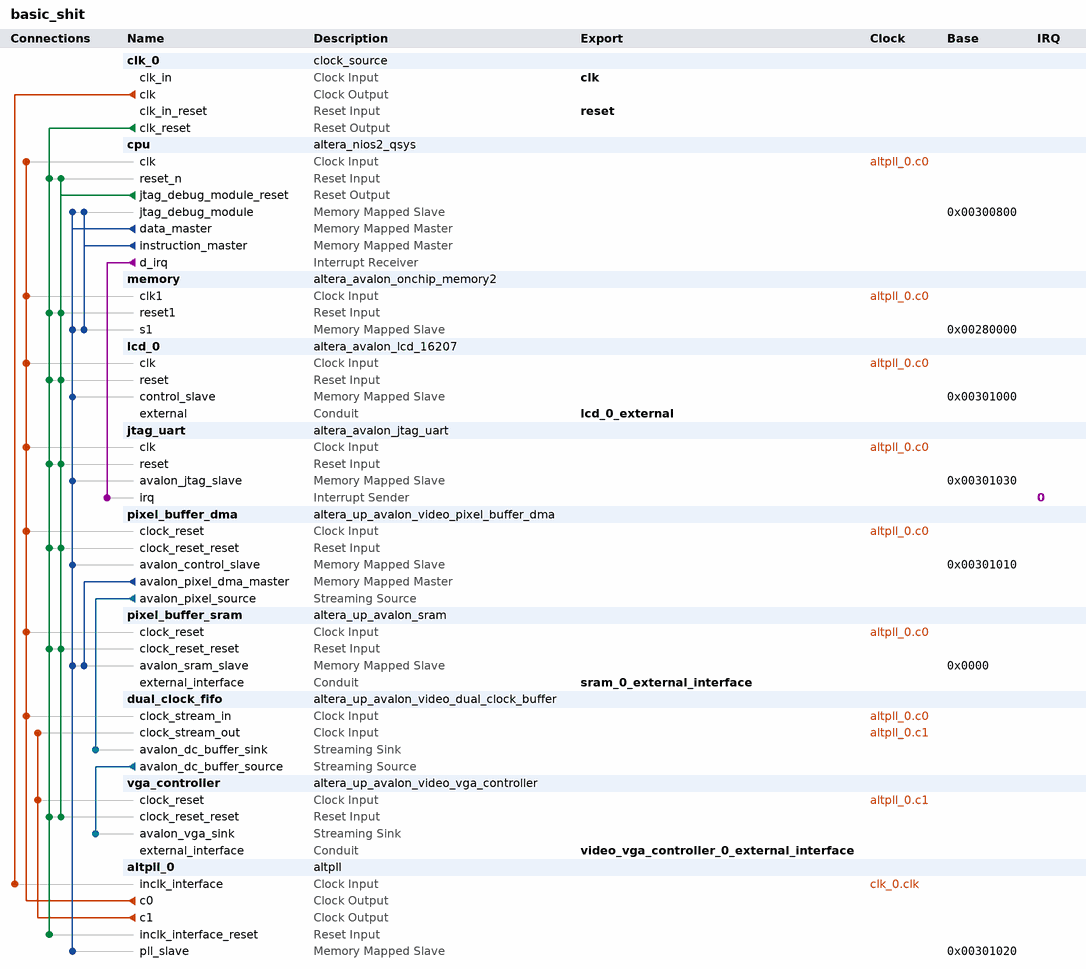
[diagram p0: system contents]
# Platform Designer (Qsys) system basic_shit
# Parameters at their usual value, and those the tool derives, are not listed.
package require -exact qsys 11.0
create_system basic_shit
set_project_property DEVICE_FAMILY CYCLONEIVE

add_instance clk_0 clock_source 11.0
set_instance_parameter_value clk_0 clockFrequency 50000000

add_instance cpu altera_nios2_qsys 11.0
set_instance_parameter_value cpu manuallyAssignCpuID false
set_instance_parameter_value cpu resetSlave memory.s1
set_instance_parameter_value cpu exceptionSlave memory.s1
set_instance_parameter_value cpu breakSlave cpu.jtag_debug_module
set_instance_parameter_value cpu impl Fast
set_instance_parameter_value cpu icache_size 4096

add_instance memory altera_avalon_onchip_memory2 11.0
set_instance_parameter_value memory dataWidth 32
set_instance_parameter_value memory dualPort false
set_instance_parameter_value memory initMemContent true
set_instance_parameter_value memory initializationFileName memory
set_instance_parameter_value memory memorySize 310000

add_instance lcd_0 altera_avalon_lcd_16207 11.0

add_instance jtag_uart altera_avalon_jtag_uart 11.0
set_instance_parameter_value jtag_uart simInteractiveOptions INTERACTIVE_ASCII_OUTPUT

add_instance pixel_buffer_dma altera_up_avalon_video_pixel_buffer_dma 11.0
set_instance_parameter_value pixel_buffer_dma addr_mode X-Y
set_instance_parameter_value pixel_buffer_dma start_address 0
set_instance_parameter_value pixel_buffer_dma back_start_address 0
set_instance_parameter_value pixel_buffer_dma image_width 640
set_instance_parameter_value pixel_buffer_dma image_height 480
set_instance_parameter_value pixel_buffer_dma color_space {30-bit RGB}

add_instance pixel_buffer_sram altera_up_avalon_sram 11.0
set_instance_parameter_value pixel_buffer_sram board DE2-115
set_instance_parameter_value pixel_buffer_sram pixel_buffer true

add_instance dual_clock_fifo altera_up_avalon_video_dual_clock_buffer 11.0
set_instance_parameter_value dual_clock_fifo color_bits 10

add_instance vga_controller altera_up_avalon_video_vga_controller 11.0
set_instance_parameter_value vga_controller board DE2-115

add_instance altpll_0 altpll 11.0
set_instance_parameter_value altpll_0 INCLK0_INPUT_FREQUENCY 20000
set_instance_parameter_value altpll_0 CLK0_MULTIPLY_BY 1
set_instance_parameter_value altpll_0 CLK1_MULTIPLY_BY 1
set_instance_parameter_value altpll_0 CLK0_DIVIDE_BY 1
set_instance_parameter_value altpll_0 CLK1_DIVIDE_BY 2
set_instance_parameter_value altpll_0 CLK1_PHASE_SHIFT 0
set_instance_parameter_value altpll_0 CLK1_DUTY_CYCLE 50
set_instance_parameter_value altpll_0 PORT_clk1 PORT_USED
set_instance_parameter_value altpll_0 PORT_clk2 PORT_UNUSED
set_instance_parameter_value altpll_0 PORT_clk3 PORT_UNUSED
set_instance_parameter_value altpll_0 PORT_ARESET PORT_UNUSED
set_instance_parameter_value altpll_0 PORT_LOCKED PORT_UNUSED

# connections
add_connection altpll_0.c0 cpu.clk clock
add_connection altpll_0.c0 dual_clock_fifo.clock_stream_in clock
add_connection altpll_0.c0 jtag_uart.clk clock
add_connection altpll_0.c0 lcd_0.clk clock
add_connection altpll_0.c0 memory.clk1 clock
add_connection altpll_0.c0 pixel_buffer_dma.clock_reset clock
add_connection altpll_0.c0 pixel_buffer_sram.clock_reset clock
add_connection altpll_0.c1 dual_clock_fifo.clock_stream_out clock
add_connection altpll_0.c1 vga_controller.clock_reset clock
add_connection clk_0.clk altpll_0.inclk_interface clock
add_connection clk_0.clk_reset altpll_0.inclk_interface_reset reset
add_connection clk_0.clk_reset cpu.reset_n reset
add_connection clk_0.clk_reset jtag_uart.reset reset
add_connection clk_0.clk_reset lcd_0.reset reset
add_connection clk_0.clk_reset memory.reset1 reset
add_connection clk_0.clk_reset pixel_buffer_dma.clock_reset_reset reset
add_connection clk_0.clk_reset pixel_buffer_sram.clock_reset_reset reset
add_connection clk_0.clk_reset vga_controller.clock_reset_reset reset
add_connection cpu.jtag_debug_module_reset cpu.reset_n reset
add_connection cpu.jtag_debug_module_reset jtag_uart.reset reset
add_connection cpu.jtag_debug_module_reset lcd_0.reset reset
add_connection cpu.jtag_debug_module_reset memory.reset1 reset
add_connection cpu.jtag_debug_module_reset pixel_buffer_dma.clock_reset_reset reset
add_connection cpu.jtag_debug_module_reset pixel_buffer_sram.clock_reset_reset reset
add_connection cpu.jtag_debug_module_reset vga_controller.clock_reset_reset reset
add_connection cpu.data_master altpll_0.pll_slave avalon
set_connection_parameter_value cpu.data_master/altpll_0.pll_slave baseAddress 0x00301020
add_connection cpu.data_master cpu.jtag_debug_module avalon
set_connection_parameter_value cpu.data_master/cpu.jtag_debug_module baseAddress 0x00300800
add_connection cpu.data_master jtag_uart.avalon_jtag_slave avalon
set_connection_parameter_value cpu.data_master/jtag_uart.avalon_jtag_slave baseAddress 0x00301030
add_connection cpu.data_master lcd_0.control_slave avalon
set_connection_parameter_value cpu.data_master/lcd_0.control_slave baseAddress 0x00301000
add_connection cpu.data_master memory.s1 avalon
set_connection_parameter_value cpu.data_master/memory.s1 baseAddress 0x00280000
add_connection cpu.data_master pixel_buffer_dma.avalon_control_slave avalon
set_connection_parameter_value cpu.data_master/pixel_buffer_dma.avalon_control_slave baseAddress 0x00301010
add_connection cpu.data_master pixel_buffer_sram.avalon_sram_slave avalon
set_connection_parameter_value cpu.data_master/pixel_buffer_sram.avalon_sram_slave baseAddress 0x0000
add_connection cpu.instruction_master cpu.jtag_debug_module avalon
set_connection_parameter_value cpu.instruction_master/cpu.jtag_debug_module baseAddress 0x00300800
add_connection cpu.instruction_master memory.s1 avalon
set_connection_parameter_value cpu.instruction_master/memory.s1 baseAddress 0x00280000
add_connection pixel_buffer_dma.avalon_pixel_dma_master pixel_buffer_sram.avalon_sram_slave avalon
set_connection_parameter_value pixel_buffer_dma.avalon_pixel_dma_master/pixel_buffer_sram.avalon_sram_slave baseAddress 0x0000
add_connection dual_clock_fifo.avalon_dc_buffer_source vga_controller.avalon_vga_sink avalon_streaming
add_connection pixel_buffer_dma.avalon_pixel_source dual_clock_fifo.avalon_dc_buffer_sink avalon_streaming
add_connection cpu.d_irq jtag_uart.irq interrupt
set_connection_parameter_value cpu.d_irq/jtag_uart.irq irqNumber 0

# exported interfaces
add_interface clk clock sink
set_interface_property clk EXPORT_OF clk_0.clk_in
add_interface reset reset sink
set_interface_property reset EXPORT_OF clk_0.clk_in_reset
add_interface lcd_0_external conduit end
set_interface_property lcd_0_external EXPORT_OF lcd_0.external
add_interface sram_0_external_interface conduit end
set_interface_property sram_0_external_interface EXPORT_OF pixel_buffer_sram.external_interface
add_interface video_vga_controller_0_external_interface conduit end
set_interface_property video_vga_controller_0_external_interface EXPORT_OF vga_controller.external_interface

save_system basic_shit.qsys
